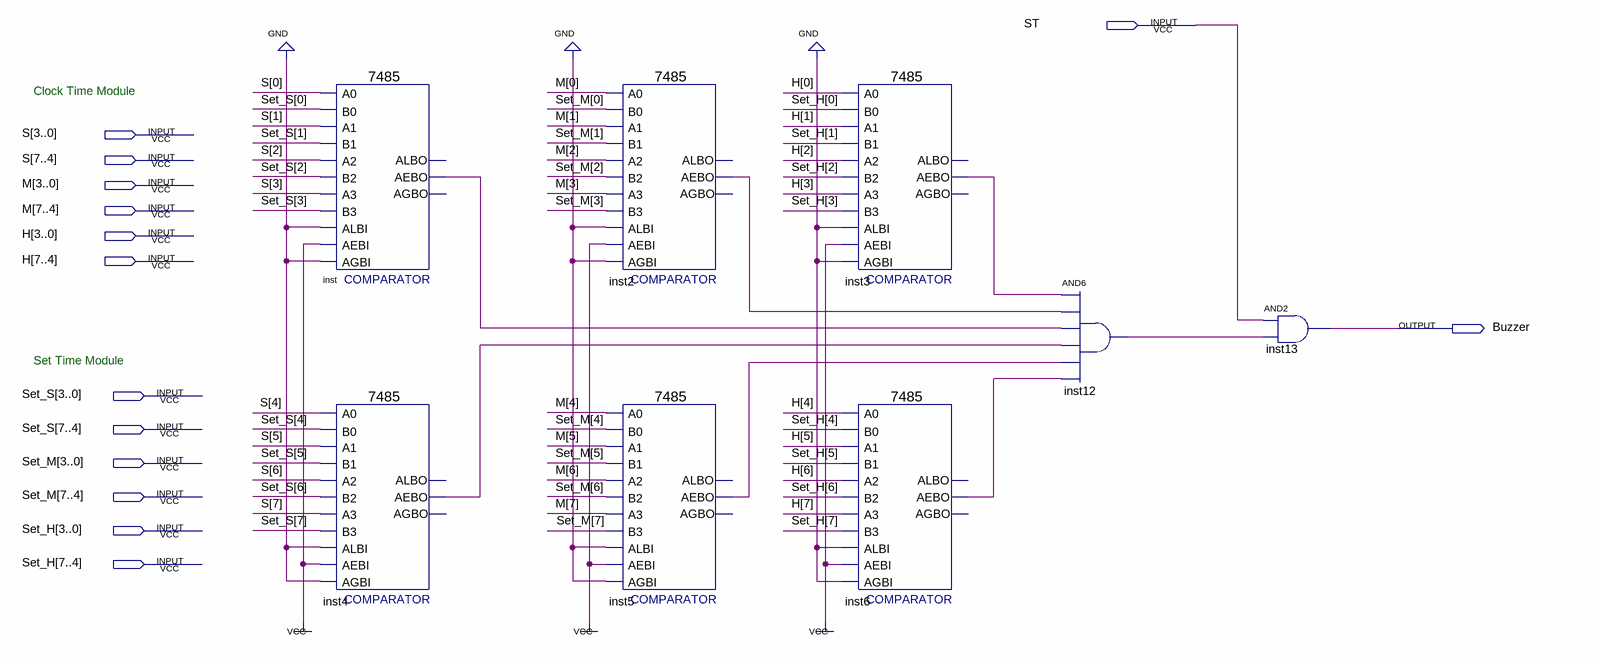
[diagram p0: schematic sheet]
// Quartus schematic Buzzer_Clock.bdf as structural Verilog: 8 symbols, 14 pins
module Buzzer_Clock (
  input  ST,
  input  [7:0] S,
  input  [7:0] M,
  input  [7:0] H,
  input  [7:0] Set_S,
  input  [7:0] Set_M,
  input  [7:0] Set_H,
  output Buzzer
);

  wire inst2_aebo, inst3_aebo, inst4_aebo, inst5_aebo, inst6_aebo, inst12_out, inst_aebo;

  \7485  inst (
    .A3(S[3]), .B2(Set_S[2]), .A2(S[2]), .AEBI(1'b1), .AGBI(1'b0), .ALBI(1'b0), .A0(S[0]), .B0(Set_S[0]),
    .B3(Set_S[3]), .A1(S[1]), .B1(Set_S[1]), .AEBO(inst_aebo));  // open: ALBO, AGBO
  \7485  inst4 (
    .A3(S[7]), .B2(Set_S[6]), .A2(S[6]), .AEBI(1'b1), .AGBI(1'b0), .ALBI(1'b0), .A0(S[4]), .B0(Set_S[4]),
    .B3(Set_S[7]), .A1(S[5]), .B1(Set_S[5]), .AEBO(inst4_aebo));  // open: ALBO, AGBO
  \7485  inst2 (
    .A3(M[3]), .B2(Set_M[2]), .A2(M[2]), .AEBI(1'b1), .AGBI(1'b0), .ALBI(1'b0), .A0(M[0]), .B0(Set_M[0]),
    .B3(Set_M[3]), .A1(M[1]), .B1(Set_M[1]), .AEBO(inst2_aebo));  // open: ALBO, AGBO
  \7485  inst5 (
    .A3(M[7]), .B2(Set_M[6]), .A2(M[6]), .AEBI(1'b1), .AGBI(1'b0), .ALBI(1'b0), .A0(M[4]), .B0(Set_M[4]),
    .B3(Set_M[7]), .A1(M[5]), .B1(Set_M[5]), .AEBO(inst5_aebo));  // open: ALBO, AGBO
  \7485  inst3 (
    .A3(H[3]), .B2(Set_H[2]), .A2(H[2]), .AEBI(1'b1), .AGBI(1'b0), .ALBI(1'b0), .A0(H[0]), .B0(Set_H[0]),
    .B3(Set_H[3]), .A1(H[1]), .B1(Set_H[1]), .AEBO(inst3_aebo));  // open: ALBO, AGBO
  \7485  inst6 (
    .A3(H[7]), .B2(Set_H[6]), .A2(H[6]), .AEBI(1'b1), .AGBI(1'b0), .ALBI(1'b0), .A0(H[4]), .B0(Set_H[4]),
    .B3(Set_H[7]), .A1(H[5]), .B1(Set_H[5]), .AEBO(inst6_aebo));  // open: ALBO, AGBO
  and inst12 (inst12_out, inst3_aebo, inst2_aebo, inst_aebo, inst4_aebo, inst5_aebo, inst6_aebo);
  and inst13 (Buzzer, ST, inst12_out);

  // Notes on the sheet:
  //   Clock Time Module
  //   Set Time Module
endmodule
